# EAGLE design eib-64_center (EAGLE 8.3.2)
DESIGNER: JON NEWMAN; DESIGN_NAME: EIB-64; LICENSE: CERN OHL v1.2; REVISION: 1.0
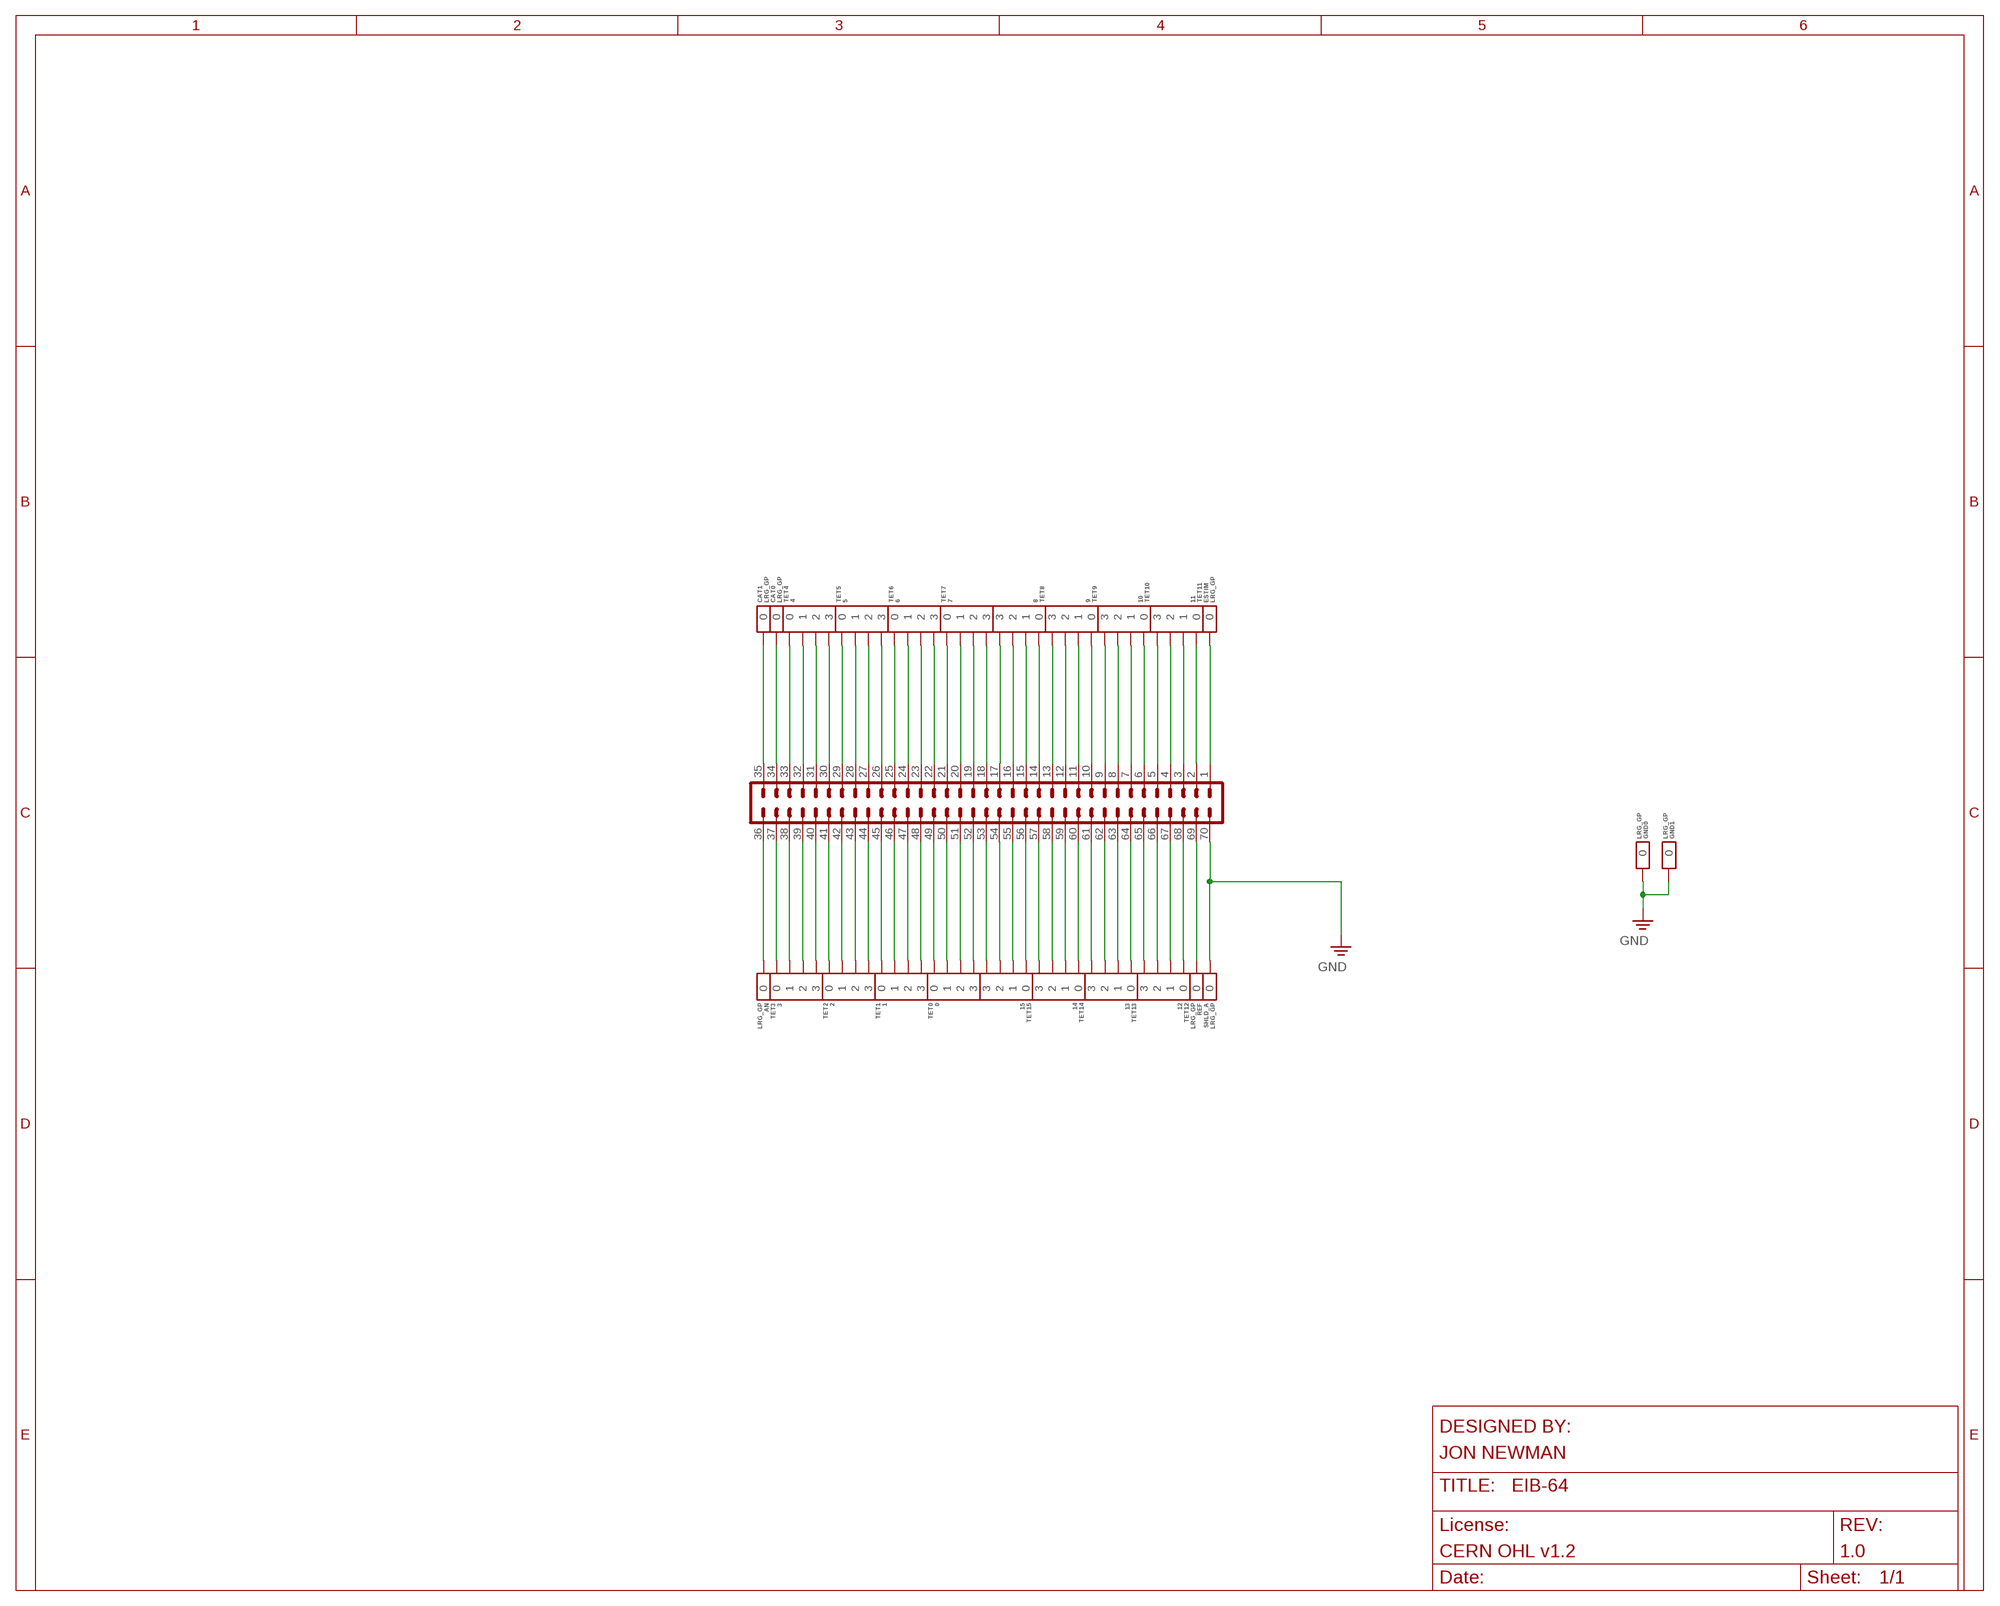
[diagram p0: schematic, sheet 1]

## Parts
AN  LRG_GP  GOLDPIN_0.5ID_0.7OD  [GOLDPIN_0.5ID_0.7OD]
CAT0  LRG_GP  GOLDPIN_0.5ID_0.7OD  [GOLDPIN_0.5ID_0.7OD]
CAT1  LRG_GP  GOLDPIN_0.5ID_0.7OD  [GOLDPIN_0.5ID_0.7OD]
ESTIM  LRG_GP  GOLDPIN_0.5ID_0.7OD  [GOLDPIN_0.5ID_0.7OD]
GND0  LRG_GP  GOLDPIN_0.5ID_0.7OD  [GOLDPIN_0.5ID_0.7OD]
GND1  LRG_GP  GOLDPIN_0.5ID_0.7OD  [GOLDPIN_0.5ID_0.7OD]
REF  LRG_GP  GOLDPIN_0.5ID_0.7OD  [GOLDPIN_0.5ID_0.7OD]
SHLD_A  LRG_GP  GOLDPIN_0.5ID_0.7OD  [GOLDPIN_0.5ID_0.7OD]
TET0  0  TETRODE_0.3ID_LINEAR_MOUSE  [TETRODE_0.3ID_LINEAR_MOUSE]
TET1  1  TETRODE_0.3ID_LINEAR_MOUSE  [TETRODE_0.3ID_LINEAR_MOUSE]
TET2  2  TETRODE_0.3ID_LINEAR_MOUSE  [TETRODE_0.3ID_LINEAR_MOUSE]
TET3  3  TETRODE_0.3ID_LINEAR_MOUSE  [TETRODE_0.3ID_LINEAR_MOUSE]
TET4  4  TETRODE_0.3ID_LINEAR_MOUSE  [TETRODE_0.3ID_LINEAR_MOUSE]
TET5  5  TETRODE_0.3ID_LINEAR_MOUSE  [TETRODE_0.3ID_LINEAR_MOUSE]
TET6  6  TETRODE_0.3ID_LINEAR_MOUSE  [TETRODE_0.3ID_LINEAR_MOUSE]
TET7  7  TETRODE_0.3ID_LINEAR_MOUSE  [TETRODE_0.3ID_LINEAR_MOUSE]
TET8  8  TETRODE_0.3ID_LINEAR_MOUSE  [TETRODE_0.3ID_LINEAR_MOUSE]
TET9  9  TETRODE_0.3ID_LINEAR_MOUSE  [TETRODE_0.3ID_LINEAR_MOUSE]
TET10  10  TETRODE_0.3ID_LINEAR_MOUSE  [TETRODE_0.3ID_LINEAR_MOUSE]
TET11  11  TETRODE_0.3ID_LINEAR_MOUSE  [TETRODE_0.3ID_LINEAR_MOUSE]
TET12  12  TETRODE_0.3ID_LINEAR_MOUSE  [TETRODE_0.3ID_LINEAR_MOUSE]
TET13  13  TETRODE_0.3ID_LINEAR_MOUSE  [TETRODE_0.3ID_LINEAR_MOUSE]
TET14  14  TETRODE_0.3ID_LINEAR_MOUSE  [TETRODE_0.3ID_LINEAR_MOUSE]
TET15  15  TETRODE_0.3ID_LINEAR_MOUSE  [TETRODE_0.3ID_LINEAR_MOUSE]
U$1  PINHD-2X35_DF40REC  [DF40-70REC]

## Nets
AN: AN.P$1 U$1.36
CAT: CAT0.P$1 U$1.34
CAT1: CAT1.P$1 U$1.35
ESTIM: ESTIM.P$1 U$1.1
GND: GND0.P$1 GND1.P$1 SHLD_A.P$1 U$1.70
N$1: TET12.0 U$1.68
N$2: TET12.1 U$1.67
N$3: TET12.2 U$1.66
N$4: TET12.3 U$1.65
N$5: TET13.0 U$1.64
N$6: TET13.1 U$1.63
N$7: TET13.2 U$1.62
N$8: TET13.3 U$1.61
N$9: TET14.0 U$1.60
N$10: TET14.1 U$1.59
N$11: TET14.2 U$1.58
N$12: TET14.3 U$1.57
N$13: TET15.0 U$1.56
N$14: TET15.1 U$1.55
N$15: TET15.2 U$1.54
N$16: TET15.3 U$1.53
N$17: TET0.3 U$1.52
N$18: TET0.2 U$1.51
N$19: TET0.1 U$1.50
N$20: TET0.0 U$1.49
N$21: TET1.3 U$1.48
N$22: TET1.2 U$1.47
N$23: TET1.1 U$1.46
N$24: TET1.0 U$1.45
N$25: TET2.3 U$1.44
N$26: TET2.2 U$1.43
N$27: TET2.1 U$1.42
N$28: TET2.0 U$1.41
N$29: TET3.3 U$1.40
N$30: TET3.2 U$1.39
N$31: TET3.1 U$1.38
N$32: TET3.0 U$1.37
N$33: TET11.3 U$1.5
N$34: TET11.2 U$1.4
N$35: TET11.1 U$1.3
N$36: TET11.0 U$1.2
N$199: TET4.0 U$1.33
N$200: TET4.1 U$1.32
N$201: TET4.2 U$1.31
N$202: TET4.3 U$1.30
N$203: TET5.0 U$1.29
N$204: TET5.1 U$1.28
N$205: TET5.2 U$1.27
N$206: TET5.3 U$1.26
N$207: TET6.0 U$1.25
N$208: TET6.1 U$1.24
N$209: TET6.2 U$1.23
N$210: TET6.3 U$1.22
N$211: TET7.0 U$1.21
N$212: TET7.1 U$1.20
N$213: TET7.2 U$1.19
N$214: TET7.3 U$1.18
N$215: TET8.3 U$1.17
N$216: TET8.2 U$1.16
N$217: TET8.1 U$1.15
N$218: TET8.0 U$1.14
N$219: TET9.3 U$1.13
N$220: TET9.2 U$1.12
N$221: TET9.1 U$1.11
N$222: TET9.0 U$1.10
N$223: TET10.3 U$1.9
N$224: TET10.2 U$1.8
N$225: TET10.1 U$1.7
N$226: TET10.0 U$1.6
REF: REF.P$1 U$1.69

## Library data of the parts
AN CAT0 CAT1 ESTIM GND0 GND1 REF SHLD_A = jonnew:GOLDPIN
TET0 TET1-TET15 = jonnew:TETRODE
U$1 = jonnew:PINHD-2X35

## Board
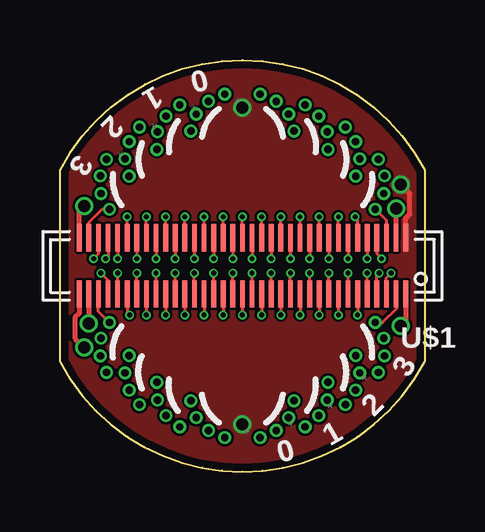
[diagram p1: board, top side]
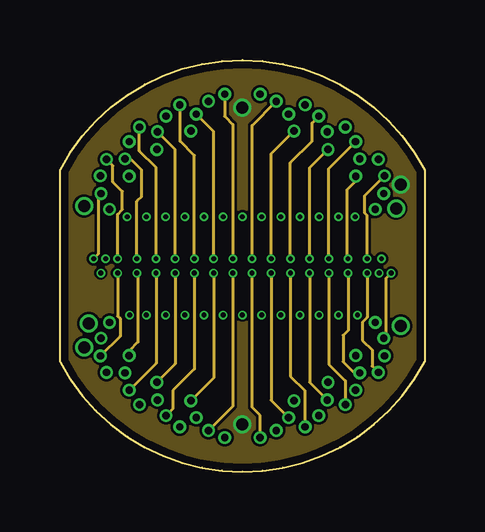
[diagram p2: board, inner layer Route2]
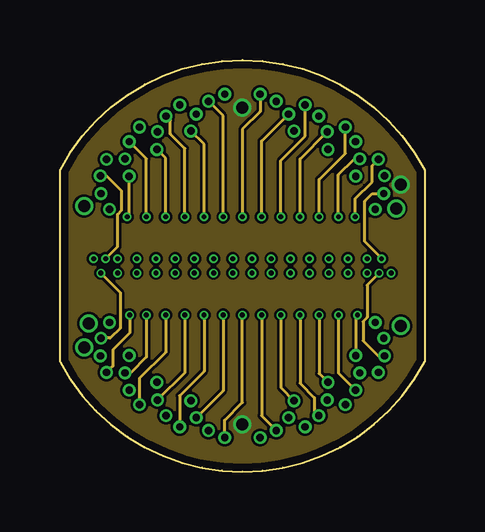
[diagram p3: board, inner layer Route15]
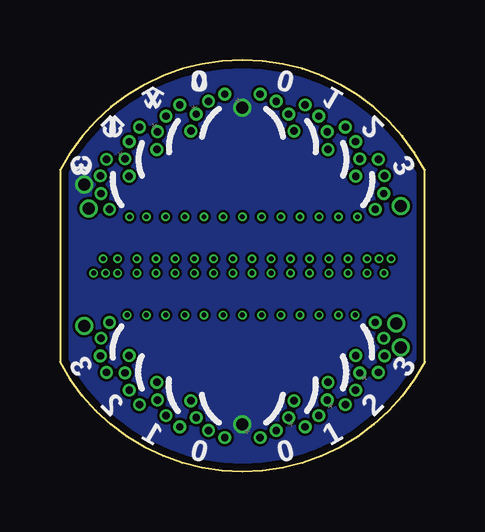
[diagram p4: board, bottom side, seen from below]

Size 15.2 x 17.18 mm. Coordinates in mm from the lower left corner, seen from the top.
Outline: 0,4.59 0,12.59 arc-124 15.2,12.59 15.2,4.59 arc-124 0,4.59
Copper layers (1+2*15+16): Top 0.035mm / dielectric 1.5mm / Route2 0.035mm / dielectric 0.15mm / Route15 0.035mm / dielectric 0.2mm / Bottom 0.035mm
Design rules "pcb-cart-standard-4-layer": minimum track width 3mil, minimum drill 6mil, track to track 4mil, track to pad 4mil, pad to pad 4mil, via to via 4mil, smd to smd 4mil, copper to edge 12mil, drill to drill 6mil, minimum pad ring 3mil, minimum via ring 3mil, stop-mask expansion 2mil, vias tented up to drill 20mil, thermal gap 10mil
tKeepout: area -0.4,0.5 to 15.6,16.6

### Footprints (pad centres in the part's own frame; a part is rotated, then mirrored left to right if it is on the bottom)
GOLDPIN_0.5ID_0.7OD = drill 0.5 pad 0.7: P$1 0,0
TETRODE_0.3ID_LINEAR_MOUSE = drill 0.305 pad 0.533: 0 2,5.68; 1 1.76,6.38; 2 1.23,6.9; 3 0.55,7.18
DF40-70REC = smd 0.2 x 1.14: 1 -6.8,1.17; 2 -6.4,1.17; 3 -6,1.17; 4 -5.6,1.17; 5 -5.2,1.17; 6 -4.8,1.17; 7 -4.4,1.17; 8 -4,1.17; 9 -3.6,1.17; 10 -3.2,1.17; 11 -2.8,1.17; 12 -2.4,1.17; 13 -2,1.17; 14 -1.6,1.17; 15 -1.2,1.17; 16 -0.8,1.17; 17 -0.4,1.17; 18 0,1.17; 19 0.4,1.17; 20 0.8,1.17; 21 1.2,1.17; 22 1.6,1.17; 23 2,1.17; 24 2.4,1.17; 25 2.8,1.17; 26 3.2,1.17; 27 3.6,1.17; 28 4,1.17; 29 4.4,1.17; 30 4.8,1.17; 31 5.2,1.17; 32 5.6,1.17; 33 6,1.17; 34 6.4,1.17; 35 6.8,1.17; 36 6.8,-1.17; 37 6.4,-1.17; 38 6,-1.17; 39 5.6,-1.17; 40 5.2,-1.17; 41 4.8,-1.17; 42 4.4,-1.17; 43 4,-1.17; 44 3.6,-1.17; 45 3.2,-1.17; 46 2.8,-1.17; 47 2.4,-1.17; 48 2,-1.17; 49 1.6,-1.17; 50 1.2,-1.17; 51 0.8,-1.17; 52 0.4,-1.17; 53 0,-1.17; 54 -0.4,-1.17; 55 -0.8,-1.17; 56 -1.2,-1.17; 57 -1.6,-1.17; 58 -2,-1.17; 59 -2.4,-1.17; 60 -2.8,-1.17; 61 -3.2,-1.17; 62 -3.6,-1.17; 63 -4,-1.17; 64 -4.4,-1.17; 65 -4.8,-1.17; 66 -5.2,-1.17; 67 -5.6,-1.17; 68 -6,-1.17; 69 -6.4,-1.17; 70 -6.8,-1.17

### Placement (x,y rotation side)
AN  1,11.09 0 top
CAT0  1.2,6.19 0 top
CAT1  1,5.19 0 top
ESTIM  14.2,6.09 0 top
GND0  7.6,15.19 0 top
GND1  7.6,1.99 0 top
REF  14,10.99 0 top
SHLD_A  14.2,11.99 0 top
TET0  7.6,8.59 358.5 bottom
TET1  7.6,8.59 343.1 bottom
TET2  7.6,8.59 327.8 bottom
TET3  7.6,8.59 312.5 bottom
TET4  7.6,8.59 132.5 top
TET5  7.6,8.59 147.8 top
TET6  7.6,8.59 163.1 top
TET7  7.6,8.59 178.5 top
TET8  7.6,8.59 178.5 bottom
TET9  7.6,8.59 163.1 bottom
TET10  7.6,8.59 147.8 bottom
TET11  7.6,8.59 132.5 bottom
TET12  7.6,8.59 312.5 top
TET13  7.6,8.59 327.8 top
TET14  7.6,8.59 343.1 top
TET15  7.6,8.59 358.5 top
U$1  7.6,8.59 180 top

### Tracks (layer width: path | path; a pad name or v marks a point on that pad's centre or on a via)
AN
  Top 0.2: U$1.36 0.8,10.89 AN.P$1
CAT
  Top 0.2: U$1.34 CAT0.P$1
CAT1
  Top 0.2: U$1.35 0.8,6.6 0.62,6.43 0.62,5.57 CAT1.P$1
ESTIM
  Top 0.2: U$1.1 14.4,6.29 ESTIM.P$1
GND
  Top 0.2: U$1.70 14.4,10.57 14.58,10.75 14.58,11.61 SHLD_A.P$1
  pour Bottom (no thermals): -2.95,19.94 18.05,19.94 18.05,-3.06 -2.95,-3.06
  pour Top (no thermals): -5.95,22.94 21.05,22.94 21.05,-6.06 -5.95,-6.06
  pour Route15 (no thermals): -3.95,20.94 19.05,20.94 19.05,-4.06 -3.95,-4.06
  pour Route2 (no thermals): -4.95,21.94 20.05,21.94 20.05,-5.06 -4.95,-5.06
N$1
  Top 0.127: TET12.0 13.6,10.49 U$1.68
N$2  (via drill 0.2)
  Top 0.127: U$1.67 13.2,9.1 v13.4,8.89
  Route15 0.127: v13.4,8.89 12.7,9.6 12.7,11.29 13.01,11.6 TET12.1
N$3  (via drill 0.2)
  Top 0.127: U$1.66 v12.8,8.89
  Route2 0.127: v12.8,8.89 12.8,10.69 12.7,10.79 12.7,11.53 TET12.2
N$4  (via drill 0.2)
  Top 0.127: U$1.65 12.4,10.54 v12.3,10.64
  Route15 0.127: v12.3,10.64 12.3,11.39 13,12.09 13,12.77 TET12.3
N$5  (via drill 0.2)
  Top 0.127: U$1.64 v12,8.89
  Route2 0.127: TET13.0 12.32,12.13 11.96,11.77 11.96,8.95 12,8.91 v12,8.89
N$6  (via drill 0.2)
  Top 0.127: U$1.63 v11.6,10.64
  Route15 0.127: v11.6,10.64 11.6,12.39 12.26,13.05 TET13.1
N$7  (via drill 0.2)
  Top 0.127: U$1.62 v11.2,8.89
  Route2 0.127: v11.2,8.89 11.2,12.65 TET13.2
N$8  (via drill 0.2)
  Top 0.127: U$1.61 v10.8,10.64
  Route15 0.127: v10.8,10.64 10.8,12.19 11.89,13.28 TET13.3
N$9  (via drill 0.2)
  Top 0.127: U$1.60 v10.4,8.89
  Route2 0.127: TET14.0 10.4,12.68 v10.4,8.89
N$10  (via drill 0.2)
  Top 0.127: U$1.59 v10,10.64
  Route15 0.127: v10,10.64 10,13.04 TET14.1
N$11  (via drill 0.2)
  Top 0.127: U$1.58 v9.6,8.89
  Route2 0.127: TET14.2 10.5,14.55 10.5,13.79 9.6,12.89 v9.6,8.89
N$12  (via drill 0.2)
  Top 0.127: U$1.57 v9.2,10.64
  Route15 0.127: v9.2,10.64 9.2,12.99 10.21,14 TET14.3
N$13  (via drill 0.2)
  Top 0.127: U$1.56 v8.8,8.89
  Route2 0.127: TET15.0 8.8,13.27 v8.8,8.89
N$14  (via drill 0.2)
  Top 0.127: U$1.55 v8.4,10.64
  Route15 0.127: v8.4,10.64 8.4,13.79 TET15.1
N$15  (via drill 0.2)
  Top 0.127: U$1.54 v8,8.89
  Route2 0.127: TET15.2 8,14.44 v8,8.89
N$16  (via drill 0.2)
  Top 0.127: U$1.53 v7.6,10.64
  Route15 0.127: TET15.3 8.34,15.03 7.6,14.29 v7.6,10.64
N$17  (via drill 0.2)
  Top 0.127: U$1.52 v7.2,8.89
  Route2 0.127: TET0.3 6.86,14.83 7.2,14.49 v7.2,8.89
N$18  (via drill 0.2)
  Top 0.127: U$1.51 v6.8,10.64
  Route15 0.127: v6.8,10.64 6.8,14.84 TET0.2
N$19  (via drill 0.2)
  Top 0.127: U$1.50 v6.4,8.89
  Route2 0.127: TET0.1 6.4,14.19 v6.4,8.89
N$20  (via drill 0.2)
  Top 0.127: U$1.49 v6,10.64
  Route15 0.127: v6,10.64 6,13.67 TET0.0
N$21  (via drill 0.2)
  Top 0.127: U$1.48 v5.6,8.89
  Route2 0.127: TET1.3 5,15.29 5,13.79 5.6,13.19 v5.6,8.89
N$22  (via drill 0.2)
  Top 0.127: U$1.47 v5.2,10.64
  Route15 0.127: v5.2,10.64 5.2,13.49 4.6,14.09 4.6,14.65 TET1.2
N$23  (via drill 0.2)
  Top 0.127: U$1.46 v4.8,8.89
  Route2 0.127: TET1.1 4.8,13.44 v4.8,8.89
N$24  (via drill 0.2)
  Top 0.127: U$1.45 v4.4,10.64
  Route15 0.127: v4.4,10.64 4.4,13.08 TET1.0
N$25  (via drill 0.2)
  Top 0.127: U$1.44 v4,8.89
  Route2 0.127: TET2.3 3.31,13.38 4,12.69 v4,8.89
N$26  (via drill 0.2)
  Top 0.127: U$1.43 v3.6,10.64
  Route15 0.127: v3.6,10.64 3.6,13.05 TET2.2
N$27  (via drill 0.2)
  Top 0.127: U$1.42 v3.2,8.89
  Route2 0.127: v3.2,8.89 3.2,11.29 3.4,11.49 3.4,12.59 2.94,13.05 TET2.1
N$28  (via drill 0.2)
  Top 0.127: U$1.41 v2.8,10.64
  Route15 0.127: v2.8,10.64 2.88,10.72 TET2.0
N$29  (via drill 0.2)
  Top 0.127: U$1.40 v2.4,8.89
  Route2 0.127: v2.4,8.89 2.4,10.74 2.6,10.94 2.6,11.69 2.2,12.09 2.2,12.77 TET3.3
N$30  (via drill 0.2)
  Top 0.127: U$1.39 2,8.99 v1.9,8.89
  Route15 0.127: v1.9,8.89 2.4,9.39 2.4,10.74 2.57,10.91 2.57,11.72 1.94,12.34 TET3.2
N$31  (via drill 0.2)
  Top 0.127: U$1.38 1.6,9.09 v1.4,8.89
  Route2 0.127: TET3.1 1.6,11.49 1.6,9.09 v1.4,8.89
N$32
  Top 0.127: U$1.37 1.2,10.39 1.76,10.95 TET3.0
N$33  (via drill 0.2)
  Top 0.127: U$1.5 v12.8,8.29
  Route2 0.127: v12.8,8.29 12.8,6.44 12.6,6.24 12.6,5.49 13,5.09 13,4.41 TET11.3
N$34  (via drill 0.2)
  Top 0.127: U$1.4 13.2,8.19 v13.3,8.29
  Route15 0.127: v13.3,8.29 12.8,7.79 12.8,6.44 12.63,6.27 12.63,5.46 13.25,4.83 TET11.2
N$35  (via drill 0.2)
  Top 0.127: U$1.3 13.6,8.09 v13.8,8.29
  Route2 0.127: TET11.1 13.6,5.68 13.6,8.09 v13.8,8.29
N$36
  Top 0.127: U$1.2 14,6.79 13.44,6.23 TET11.0
N$199
  Top 0.127: TET4.0 1.6,6.69 U$1.33
N$200  (via drill 0.2)
  Top 0.127: U$1.32 2,7.99 v1.7,8.29
  Route15 0.127: TET4.1 2.09,5.58 2.5,5.99 2.5,7.49 v1.7,8.29
N$201  (via drill 0.2)
  Top 0.127: U$1.31 v2.4,8.29
  Route2 0.127: v2.4,8.29 2.4,6.49 2.5,6.39 2.5,5.65 TET4.2
N$202  (via drill 0.2)
  Top 0.127: U$1.30 2.8,6.64 v2.9,6.54
  Route15 0.127: v2.9,6.54 2.9,5.79 2.2,5.09 2.2,4.41 TET4.3
N$203  (via drill 0.2)
  Top 0.127: U$1.29 v3.2,8.29
  Route2 0.127: TET5.0 2.88,5.05 3.24,5.41 3.24,8.23 3.2,8.27 v3.2,8.29
N$204  (via drill 0.2)
  Top 0.127: U$1.28 v3.6,6.54
  Route15 0.127: v3.6,6.54 3.6,4.79 2.94,4.13 TET5.1
N$205  (via drill 0.2)
  Top 0.127: U$1.27 v4,8.29
  Route2 0.127: v4,8.29 4,4.52 TET5.2
N$206  (via drill 0.2)
  Top 0.127: U$1.26 v4.4,6.54
  Route15 0.127: v4.4,6.54 4.4,4.99 3.31,3.9 TET5.3
N$207  (via drill 0.2)
  Top 0.127: U$1.25 v4.8,8.29
  Route2 0.127: TET6.0 4.8,4.5 v4.8,8.29
N$208  (via drill 0.2)
  Top 0.127: U$1.24 v5.2,6.54
  Route15 0.127: v5.2,6.54 5.2,4.13 TET6.1
N$209  (via drill 0.2)
  Top 0.127: U$1.23 v5.6,8.29
  Route2 0.127: TET6.2 4.7,2.63 4.7,3.39 5.6,4.29 v5.6,8.29
N$210  (via drill 0.2)
  Top 0.127: U$1.22 v6,6.54
  Route15 0.127: v6,6.54 6,4.19 4.99,3.18 TET6.3
N$211  (via drill 0.2)
  Top 0.127: U$1.21 v6.4,8.29
  Route2 0.127: TET7.0 6.4,3.91 v6.4,8.29
N$212  (via drill 0.2)
  Top 0.127: U$1.20 v6.8,6.54
  Route15 0.127: v6.8,6.54 6.8,3.38 TET7.1
N$213  (via drill 0.2)
  Top 0.127: U$1.19 v7.2,8.29
  Route2 0.127: TET7.2 7.2,2.73 v7.2,8.29
N$214  (via drill 0.2)
  Top 0.127: U$1.18 v7.6,6.54
  Route15 0.127: TET7.3 6.86,2.15 7.6,2.89 v7.6,6.54
N$215  (via drill 0.2)
  Top 0.127: U$1.17 v8,8.29
  Route2 0.127: TET8.3 8.34,2.35 8,2.69 v8,8.29
N$216  (via drill 0.2)
  Top 0.127: U$1.16 v8.4,6.54
  Route15 0.127: v8.4,6.54 8.4,2.33 TET8.2
N$217  (via drill 0.2)
  Top 0.127: U$1.15 v8.8,8.29
  Route2 0.127: TET8.1 8.8,2.98 v8.8,8.29
N$218  (via drill 0.2)
  Top 0.127: U$1.14 v9.2,6.54
  Route15 0.127: v9.2,6.54 9.2,3.51 TET8.0
N$219  (via drill 0.2)
  Top 0.127: U$1.13 v9.6,8.29
  Route2 0.127: TET9.3 10.2,1.89 10.2,3.39 9.6,3.99 v9.6,8.29
N$220  (via drill 0.2)
  Top 0.127: U$1.12 v10,6.54
  Route15 0.127: v10,6.54 10,3.69 10.6,3.09 10.6,2.53 TET9.2
N$221  (via drill 0.2)
  Top 0.127: U$1.11 v10.4,8.29
  Route2 0.127: TET9.1 10.4,3.73 v10.4,8.29
N$222  (via drill 0.2)
  Top 0.127: U$1.10 v10.8,6.54
  Route15 0.127: v10.8,6.54 10.8,4.1 TET9.0
N$223  (via drill 0.2)
  Top 0.127: U$1.9 v11.2,8.29
  Route2 0.127: TET10.3 11.89,3.8 11.2,4.49 v11.2,8.29
N$224  (via drill 0.2)
  Top 0.127: U$1.8 v11.6,6.54
  Route15 0.127: v11.6,6.54 11.6,4.12 TET10.2
N$225  (via drill 0.2)
  Top 0.127: U$1.7 v12,8.29
  Route2 0.127: v12,8.29 12,5.89 11.8,5.69 11.8,4.59 12.26,4.13 TET10.1
N$226  (via drill 0.2)
  Top 0.127: U$1.6 v12.4,6.54
  Route15 0.127: v12.4,6.54 12.32,6.46 TET10.0
REF
  Top 0.2: U$1.69 REF.P$1

### Text on the board
tPlace: 0 | 1 | 2 | 3 | 3 | 2 | 1 | 0
bPlace: 0 | 0 | 0 | 1 | 1 | 1 | 2 | 2 | 2 | 3 | 3 | 3 | 3 | 3 | 2 | 2 | 1 | 1 | 0 | 0